# Altium schematic sheet Power.SchDoc: Title
size Letter; Engineer: David Simmons; Organization: SPAWAR Systems Center Pacific; Address1: 3 Minna Close; Address2: Belrose; Address3: NSW 2085; Address4: Australia; Revision: 1; SheetNumber: 1; SheetTotal: 1; PageSetup: Record=PageOptions|CenterHorizontal=True|CenterVertical=True|PrintScale=0.94|XCorrection=1.00|YCorrection=1.00|PrintKind=0|BorderSize=5000000|LeftOffset=0|BottomOffset=0|Orientation=2|PaperLength=1000|PaperWidth=1000|Scale=100|PaperSource=15|PrintQuality=600|MediaType=1|DitherType=10|PaperKind=Letter (8.5" x 11")|PrintScaleMode=1
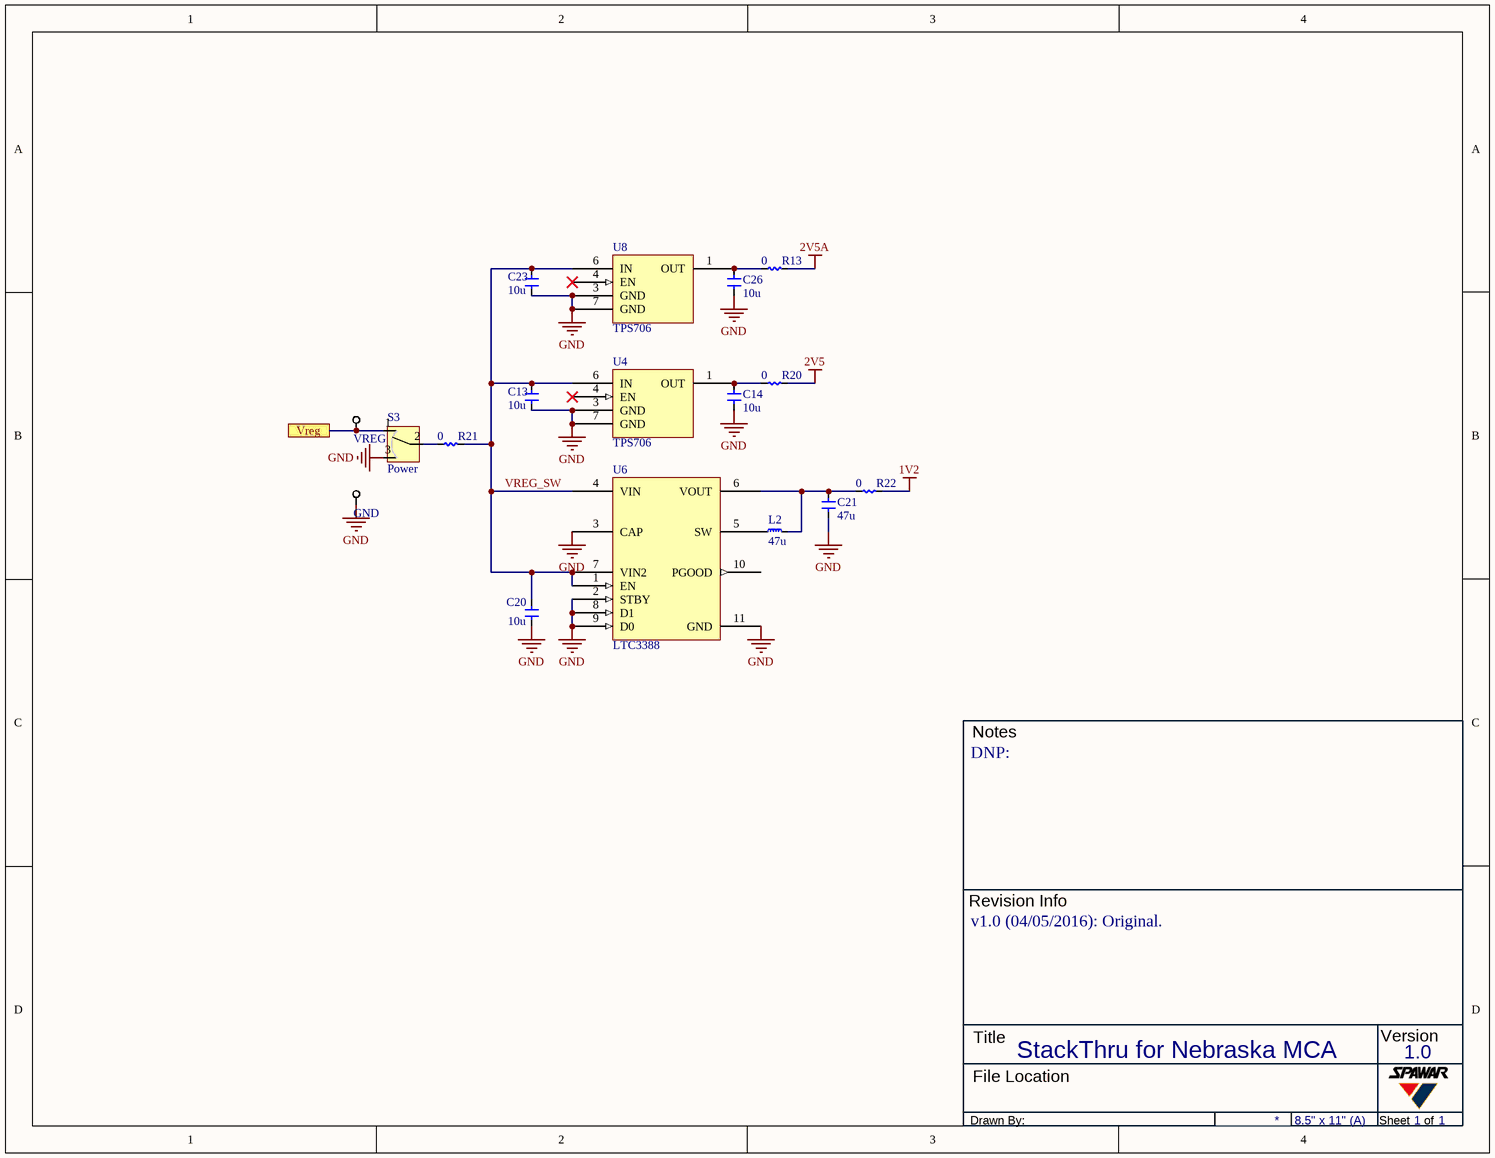
[diagram p0: Power.SchDoc]

## Parts
C13  value 10u  [CAPC1005X05N]  (hidden comment: CAP-IPC7351B)
C14  value 10u  [CAPC1005X05N]  (hidden comment: CAP-IPC7351B)
C20  value 10u  [CAPC1005X05N]  (hidden comment: CAP-IPC7351B)
C21  value 47u  [CAPC2012X12N]  (hidden comment: CAP-IPC7351B)
C23  value 10u  [CAPC1005X05N]  (hidden comment: CAP-IPC7351B)
C26  value 10u  [CAPC1005X05N]  (hidden comment: CAP-IPC7351B)
GND  Test Point  [TESTPOINT-0603]  (value not drawn)
L2  value 47u  [INDC3030X15N]  (hidden comment: MURATA-LQH3NP_M0)
R13  value 0  [RESC1005X04N]  (hidden comment: RES-IPC7351B)
R20  value 0  [RESC1005X04N]  (hidden comment: RES-IPC7351B)
R21  value 0  [RESC1005X04N]  (hidden comment: RES-IPC7351B)
R22  value 0  [RESC1005X04N]  (hidden comment: RES-IPC7351B)
S3  Power  [CKC-PCM12SMTR]
U4  TPS706  [DFN65P200X200X80_HS-7N]
U6  LTC3388  [DFN50P300X300X80_HS-11M]
U8  TPS706  [DFN65P200X200X80_HS-7N]
VREG  Test Point  [TESTPOINT-0603]  (value not drawn)

## Ports
Vreg

## Nets
1V2: R22.2
2V5: R20.2
2V5A: R13.2
GND: C13.1 C14.1 C20.1 C21.1 C23.1 C26.1 GND.1(TP) S3.3 U4.3(GND) U4.7(GND) U6.2(STBY) U6.3(CAP) U6.8(D1) U6.9(D0) U6.11(GND) U8.3(GND) U8.7(GND)
Vreg: S3.1 VREG.1(TP) ; port Vreg
VREG_SW: C13.2 C20.2 C23.2 R21.2 U4.6(IN) U6.1(EN) U6.4(VIN) U6.7(VIN2) U8.6(IN)
NetC14_2: C14.2 R20.1 U4.1(OUT)
NetC21_2: C21.2 L2.2 R22.1 U6.6(VOUT)
NetC26_2: C26.2 R13.1 U8.1(OUT)
NetL2_1: L2.1 U6.5(SW)
NetR21_1: R21.1 S3.2

Not connected (* = marked no-connect by the designer): U4 2(NC) 4(EN)* 5(NC); U6 10(PGOOD); U8 2(NC) 4(EN)* 5(NC)

## Notes on the sheet
- Notes
- DNP:
- Revision Info
- v1.0 (04/05/2016): Original.
- Title
- StackThru for Nebraska MCA
- 1.0
- Version
- Drawn By:
- File Location
- 8.5" x 11" (A)
- Sheet
- 1
- of

## Library data of the parts
C13 C14 C20 C21 C23 C26 = CAP-IPC7351B: SMD Capacitor Following IPC-7351B Based on TDK's Product Line
GND VREG = TESTPOINT: Probe Test Point
L2 = MURATA-LQH3NP_M0: MURATA - Chip Inductor (Chip Coil) Power Inductor (Wire Wound Type)
R13 R20-R22 = RES-IPC7351B: SMD Resistor Following IPC-7351B Based on Panasonics's Product Line
S3 = CKC-PCM12SMTR: C&K Components SPDT Switch, Right Angle
U4 U8 = TI-TPS706: LDO
U6 = LT-LTC3388: Linear Technology 20V High Efficiency  Nanopower Step-Down Regulator